# Altium schematic sheet LM1117_3V3_800mA.SchDoc
size A4
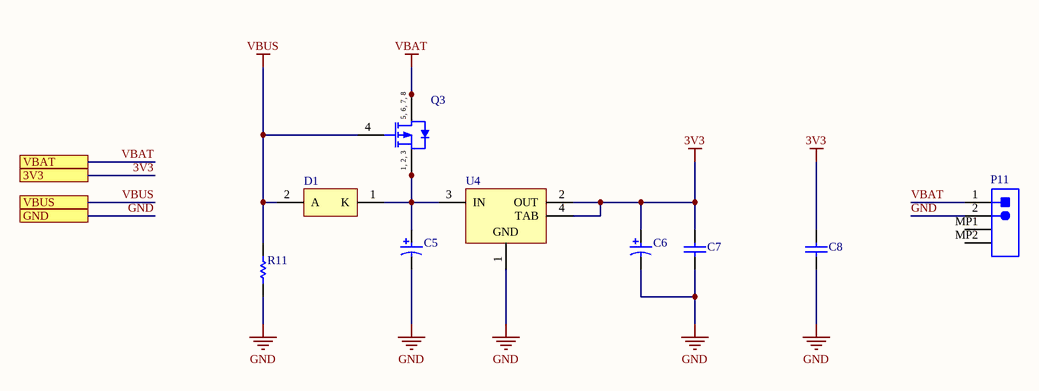
[diagram p0: LM1117_3V3_800mA.SchDoc]

## Parts
C5  T491A106K016AT  [KEMT-A-3216-18-2_N]  (value not drawn)
C6  T491A106K016AT  [KEMT-A-3216-18-2_N]  (value not drawn)
C7  C0805C105K4RAC7800  [CAPC2013X145X50ML20T25]  (value not drawn)
C8  C0805C106K4PACTU  [CAPC2013X140X50ML20T25]  (value not drawn)
D1  MBR120ESFT1G  [ONSC-SOD-123FL-2-498_V]  (value not drawn)
P11  S2B-PH-SM4-TB(LF)(SN)  [JST- S2B-PH-SM4-TB(LF)(SN)-2_V]  (value not drawn)
Q3  BSZ086P03NS3 G  [INF-PG-TSDSON-8-1_V]  (value not drawn)
R11  ERA6AEB104V  [RESC2013X60X40ML20T25]  (value not drawn)
U4  LM1117MPX-3.3/NOPB  [DCY0004A_N]  (value not drawn)

## Ports
3V3, GND, VBAT, VBUS

## Nets
3V3: C6.1 C7.2 C8.2 U4.2(OUT) U4.4(TAB) ; port 3V3
GND: C5.2 C6.2 C7.1 C8.1 P11.2 R11.1 U4.1(GND) ; port GND
VBAT: P11.1 Q3.5(DRAIN) Q3.6(DRAIN) Q3.7(DRAIN) Q3.8(DRAIN) ; port VBAT
VBUS: D1.2(A) Q3.4(GATE) R11.2 ; port VBUS
NetC5_1: C5.1 D1.1(K) Q3.1(SOURCE) Q3.2(SOURCE) Q3.3(SOURCE) U4.3(IN)

Not connected (* = marked no-connect by the designer): P11 MP1 MP2

## Notes on the sheet
- (in symbol CMP-1099-00063-1) 5, 6, 7, 8; 1, 2, 3

## Library data of the parts
C5 C6 = CMP-2000-05173-1: Capacitor, Tantalum, 10 uF, +/- 10%, 16 V, -55 to 125 degC, 2-Pin SMD (1206), RoHS, Tape and Reel; Manufacturer: Kemet; Insulation: NotRequired; Voltage: 16VDC; Capacitance: 10uF; Product Height (mm): 1.6mm; Polarity: Polar; Lead Spacing (nom): NotRequiredmm; Product Length (mm): 3.2mm; Case Style: Molded; DCL: 1.6uA; ESR: 7ohm; DF: 8%; Mounting Style: SurfaceMount; Manufacturer URL: http://www.kemet.com/; Datasheet Version: Apr-14; Package Description: 2-Pin Surface Mount Device, Body 3.2 x 1.6 mm; Operating Temp Range: -55Cto125C; Package Reference: 1206; Wire Form: NotRequired; Datasheet URL: http://www.farnell.com/datasheets/1824869.pdf; Tolerance (+ or -): 10%; Failure Rate: NotRequired; Length W/Weld: NotRequiredmm; Package / Case: 3216-18; Seated Plane Height: NotRequiredmm; Product Diameter (mm): NotRequiredmm; Construction: SMTChip; Seal: NotRequired; Case Code: A; Product Depth (mm): 1.6mm; Packaging: TapeandReel
C7 = CMP-2007-01082-1: 1µF ±10% 16V Ceramic Capacitor X7R 0805 (2012 Metric); Manufacturer: Kemet; Part Number: C0805C105K4RAC7800
C8 = CMP-2007-03242-1: 10µF ±10% 16V Ceramic Capacitor X5R 0805 (2012 Metric); Part Number: CL21A106KOQNNNG
D1 = CMP-1055-00434-1: Schottky Power Rectifier, 2-Pin SOD-123, Pb-Free, Tape and Reel; Manufacturer: On Semiconductor; Configuration: Single; IFSM Max (A): 40; ComponentLink2URL: http://www.onsemi.cn/pub_link/Collateral/MBR120ESFT1-D.PDF; PackageDescription: 2-Pin SOD, Body 1.65 x 2.7 mm; RoHS: TRUE; ComponentLink1URL: http://www.onsemi.com/; PackageVersion: Rev. D, 05/2013; PartNumber: MBR120ESFT1G; PackageReference: SOD-123FL-2-498; ComponentLink2Description: Datasheet; ComponentLink1Description: Manufacturer URL; DatasheetVersion: Rev. 4; ComponentLink3Description: Package Specification; ComponentLink3URL: http://www.onsemi.com/pub_link/Collateral/498-01.PDF; Mounting Technology: Surface Mount; Packing: Tape and Reel
P11 = CMP-1755-00001-1: Male Header, Pitch 2 mm, 1 x 2 Position, Height 5.5 mm, -25 to 85 degC, RoHS, Tape and Reel; Current Rating: 3 A; ComponentLink1URL: http://www.jst.com/home2.html; Radiation Hardening: No; RoHSCompliant: True; Mount: Through Hole; Contact Material: Bronze; Package Quantity: 100; Width: 2.34 mm; DatasheetVersion: Dec-12; Height: 8.13 mm; Max Operating Temperature: 105degC; ComponentLink2Description: Datasheet; Lead Pitch: 0.1 inch; Contact Finish: Lead; Packaging: Bulk; Colour: Black; Contact Plating: Tin; Min Operating Temperature: -65degC; ComponentLink1Description: Manufacturer URL; PackageReference: S2B-PH-SM4-TB(LF)(SN)-2; PackageDescription: Male Header, Pitch 2 mm, 1 x 2 Position, Height 5.5 mm; ComponentLink2URL: http://www.jst-mfg.com/product/pdf/eng/ePH.pdf; Pins: 40; Length: 101.19 mm
Q3 = CMP-1099-00063-1: P-Channel OptiMOS P3 Power-Transistor, -30 V VDS, -40 A ID, -55 to 150 degC, PG-TSDSON-8-1, Reel, Green; Manufacturer: Infineon; RDS (on) (max): 8.6Â mOhm; Rth: 1.8Â K/W; QG: 43.2Â nC; VGS(th) (max): -1.9Â V; RthJC (max): 1.8 K/W; Green: TRUE; Pto t (max): 69Â W; ID (max): -40Â A; IDpuls (max): -160Â A; VDS (max): -30Â V; VGS(th) (min): -3.1Â V; ComponentLink1URL: http://www.infineon.com/; ComponentLink2URL: http://www.infineon.com/dgdl/BSZ086P03NS3+G_2.03.pdf?folderId=db3a304314dca38901154a7313d21a66&fileId=db3a30431ff9881501203d3a5e7d17a9; Mounting Technology: Surface Mount; Part Number: BSZ086P03NS3 G; Packing: Reel; PackageVersion: Rev. 02, 09/2008; Halogen-free: TRUE; ComponentLink3URL: http://www.infineon.com/dgdl/BSZ240N12NS3+Rev2.0.pdf?folderId=db3a304313b8b5a60113cee8763b02d7&fileId=db3a30432a40a650012a42f3057a0038; PackageDescription: 8-Pin Plastic (Green) Thin Dual Small Outline Non-Leaded Package, 3.3 x 3.3 mm Body, 0.65 mm Pitch; PackageReference: PG-TSDSON-8-1; DatasheetVersion: Rev. 2.03; ComponentLink2Description: Datasheet; ComponentLink3Description: Package Specification; ComponentLink1Description: Manufacturer URL
R11 = CMP-2001-00583-1: 100 kOhms ±0.1% 0.125W, 1/8W Chip Resistor 0805 (2012 Metric) Automotive AEC-Q200 Thin Film; Manufacturer: Panasonic; Part Number: ERA6AEB104V
U4 = CMP-0062-01639-4: 800mA Low-Dropout Linear Regulator, 4-pin SOT-223, Pb-Free; Manufacturer: Texas Instruments; High-Reliability: Y; PowerWise: N; PackageTopMarking: XYTT*N05A; CompType: LDO IC; ComponentLink1URL: http://www.ti.com/general/docs/lit/getliterature.tsp?genericPartNumber=LM1117-N&fileType=pdf; PartNumber: LM1117MPX-3.3/NOPB; ComponentLink1Description: Datasheet URL; PinCount: 4; Code_JEDEC: TO-261-AA; PackageDescription: Molded SOT-223, 6.50 x 3.56 x 1.6mm Body, 4 Lead, 2.3mm Pitch; PackageReference: DCY0004A; RoHS: Y; Code_IPC: SOT223-4